# Altium project LcMcu.PrjPcb
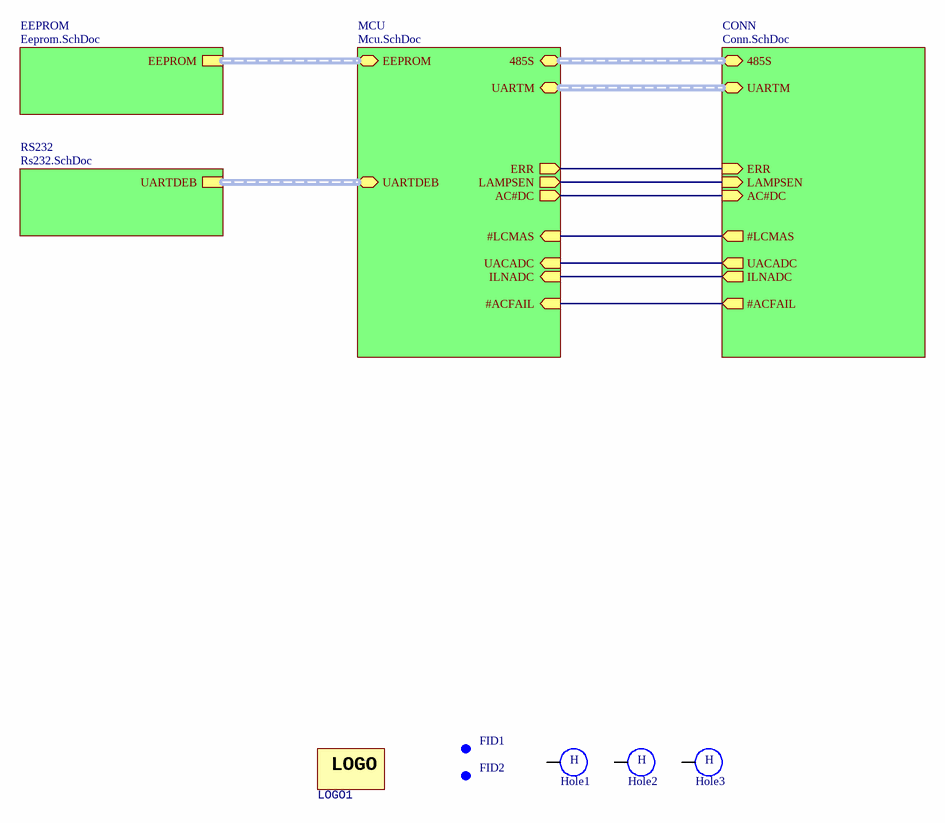
[diagram p0: Top.SchDoc]
ver: 1.0
5 sheets, 45 parts. Net scope: hierarchical (ports join the sheet entries above them; power ports are global).
Board file: LcMcu.PcbDoc
Sheets:
  Top.SchDoc
    MCU = Mcu.SchDoc
    CONN = Conn.SchDoc
    EEPROM = Eeprom.SchDoc
    RS232 = Rs232.SchDoc

## Sheet Top.SchDoc: Test
size A4; DrawnBy: Łukasz Przeniosło; Organization: Zachodniopomorski; Address1: Uniwersytet Technologiczny; Address2: w Szczecinie; Address3: Wydział Elektryczny; DocumentNumber: 1111; Revision: 1.0; SheetNumber: 0; SheetTotal: 0

### Parts
FID1  Fiducial  [Fid Round]  (value not drawn)  (no BOM)
FID2  Fiducial  [Fid Round]  (value not drawn)  (no BOM)
Hole1  Hole  [HOLE-6/3.2]  (value not drawn)
Hole2  Hole  [HOLE-6/3.2]  (value not drawn)
Hole3  Hole  [HOLE-6/3.2]  (value not drawn)
LOGO1  Logo  [LOGO_BEMKO]  (value not drawn)

### Sub-sheets
CONN = Conn.SchDoc: UACADC (out), ILNADC (out), #LCMAS (out), #ACFAIL (out), ERR (in), UARTM (harness UARTM), 485S (harness 485S), LAMPSEN (in), AC#DC (in)
EEPROM = Eeprom.SchDoc: EEPROM (harness EEPROM)
MCU = Mcu.SchDoc: UACADC (in), ILNADC (in), #ACFAIL (in), ERR (out), LAMPSEN (out), AC#DC (out), 485S (harness 485S), UARTM (harness UARTM), #LCMAS (in), EEPROM (harness EEPROM), UARTDEB
RS232 = Rs232.SchDoc: UARTDEB (harness UARTDEB)

### Nets
#ACFAIL: sheet MCU/#ACFAIL, sheet CONN/#ACFAIL
#LCMAS: sheet MCU/#LCMAS, sheet CONN/#LCMAS
AC#DC: sheet MCU/AC#DC, sheet CONN/AC#DC
ERR: sheet MCU/ERR, sheet CONN/ERR
ILNADC: sheet MCU/ILNADC, sheet CONN/ILNADC
LAMPSEN: sheet MCU/LAMPSEN, sheet CONN/LAMPSEN
UACADC: sheet MCU/UACADC, sheet CONN/UACADC

Not connected (* = marked no-connect by the designer): Hole1 1; Hole2 1; Hole3 1

### Buses and harness runs
harness sheet CONN/485S = sheet MCU/485S
harness sheet CONN/UARTM = sheet MCU/UARTM
harness sheet EEPROM/EEPROM = sheet MCU/EEPROM
harness sheet MCU/UARTDEB = sheet RS232/UARTDEB

### Notes on the sheet
- Title
- Size:
- Date:
- A4
- Author:
- Time:
- Sheet
- of
- File:
- (in symbol HOLE_) H
- (in symbol Logo) LOGO

### Library data of the parts
FID1 FID2 = FID ROUND: round fiducial
Hole1-Hole3 = HOLE_

## Sheet Mcu.SchDoc: Test
size A4; DrawnBy: Łukasz Przeniosło; Organization: Zachodniopomorski; Address1: Uniwersytet Technologiczny; Address2: w Szczecinie; Address3: Wydział Elektryczny; DocumentNumber: 1111; Revision: 1.0; SheetNumber: 0; SheetTotal: 0
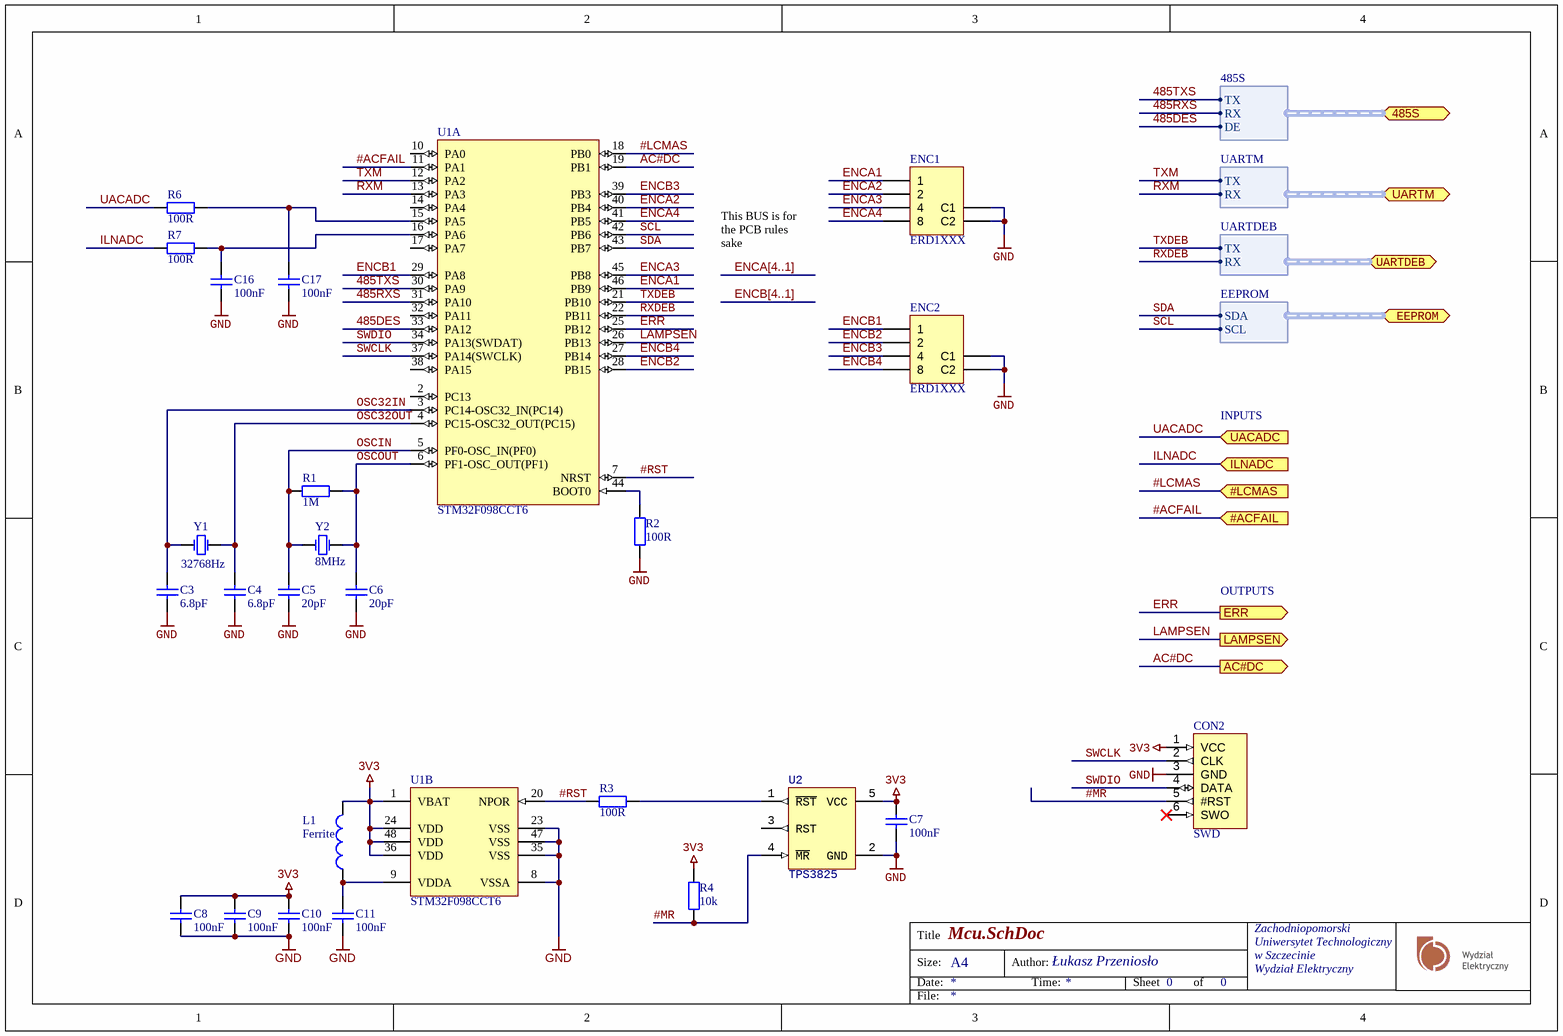
[diagram p1: Mcu.SchDoc]

### Parts
C3  6.8pF  [CAPC1608N]
C4  6.8pF  [CAPC1608N]
C5  20pF  [CAPC1608N]
C6  20pF  [CAPC1608N]
C7  100nF  [CAPC1608N]
C8  100nF  [CAPC1608N]
C9  100nF  [CAPC1608N]
C10  100nF  [CAPC1608N]
C11  100nF  [CAPC1608N]
C16  100nF  [CAPC1608N]
C17  100nF  [CAPC1608N]
CON2  SWD  [HEADER_6]
ENC1  ERD1XXX  [ERD]
ENC2  ERD1XXX  [ERD]
L1  Ferrite  [inductor_0603]
R1  1M  [RESC1608N]
R2  100R  [RESC1608N]
R3  100R  [RESC1608N]
R4  10k  [RESC1608N]
R6  100R  [RESC1608N]
R7  100R  [RESC1608N]
U1  STM32F098CCT6  [LQFP-48_L]  (parts A,B of 2)
U2  TPS3825  [SOT23-5-DBVR]
Y1  32768Hz  [ABS25-crystal]
Y2  8MHz  [HC49/4H_SMX]

### Ports
485S (harness 485S), #ACFAIL (in), #LCMAS (in), AC#DC (out), EEPROM (harness EEPROM), ERR (out), ILNADC (in), LAMPSEN (out), UACADC (in), UARTDEB (harness UARTDEB), UARTM (harness UARTM)

### Harnesses
485S: TX, RX, DE
UARTM: TX, RX
EEPROM: SDA, SCL
UARTDEB: TX, RX

### Nets
3V3: C7.2 C8.2 C9.2 C10.2 CON2.1(VCC) L1.2 R4.1 U1.1(VBAT) U1.24(VDD) U1.36(VDD) U1.48(VDD) U2.5(VCC)
GND: C3.1 C4.1 C5.2 C6.2 C7.1 C8.1 C9.1 C10.1 C11.1 C16.1 C17.2 CON2.3(GND) ENC1.C1 ENC1.C2 ENC2.C1 ENC2.C2 R2.2 U1.8(VSSA) U1.23(VSS) U1.35(VSS) U1.47(VSS) U2.2(GND)
485DES: U1.33(PA12) ; port 485S.DE
485RXS: U1.31(PA10) ; port 485S.RX
485TXS: U1.30(PA9) ; port 485S.TX
#ACFAIL: U1.11(PA1) ; port #ACFAIL
#LCMAS: U1.18(PB0) ; port #LCMAS
#MR: CON2.5(#RST) R4.2 U2.4(~{MR})
#RST: R3.1 U1.7(NRST) U1.20(NPOR)
AC#DC: U1.19(PB1) ; port AC#DC
ENCA1: ENC1.1 U1.46(PB9)
ENCA2: ENC1.2 U1.40(PB4)
ENCA3: ENC1.4 U1.45(PB8)
ENCA4: ENC1.8 U1.41(PB5)
ENCB1: ENC2.1 U1.29(PA8)
ENCB2: ENC2.2 U1.28(PB15)
ENCB3: ENC2.4 U1.39(PB3)
ENCB4: ENC2.8 U1.27(PB14)
ERR: U1.25(PB12) ; port ERR
ILNADC: R7.1 ; port ILNADC
LAMPSEN: U1.26(PB13) ; port LAMPSEN
OSC32IN: C3.2 U1.3(PC14-OSC32_IN(PC14)) Y1.1(OSC1)
OSC32OUT: C4.2 U1.4(PC15-OSC32_OUT(PC15)) Y1.2(OSC2)
OSCIN: C5.1 R1.1 U1.5(PF0-OSC_IN(PF0)) Y2.2(OSC2)
OSCOUT: C6.1 R1.2 U1.6(PF1-OSC_OUT(PF1)) Y2.1(OSC1)
RXDEB: U1.22(PB11) ; port UARTDEB.RX
RXM: U1.13(PA3) ; port UARTM.RX
SCL: U1.42(PB6) ; port EEPROM.SCL
SDA: U1.43(PB7) ; port EEPROM.SDA
SWCLK: CON2.2(CLK) U1.37(PA14(SWCLK))
SWDIO: CON2.4(DATA) U1.34(PA13(SWDAT))
TXDEB: U1.21(PB10) ; port UARTDEB.TX
TXM: U1.12(PA2) ; port UARTM.TX
UACADC: R6.1 ; port UACADC
NetC11_2: C11.2 L1.1 U1.9(VDDA)
NetC16_2: C16.2 R7.2 U1.16(PA6)
NetC17_1: C17.1 R6.2 U1.15(PA5)
NetR2_1: R2.1 U1.44(BOOT0)
NetR3_2: R3.2 U2.1(~{RST})

Not connected (* = marked no-connect by the designer): CON2 6(SWO)*; U1 2(PC13) 10(PA0) 14(PA4) 17(PA7) 32(PA11) 38(PA15); U2 3(RST)

### Buses and harness runs
bus ENCA[4..1]
bus ENCB[4..1]

### Notes on the sheet
- This BUS is for the PCB rules sake
- INPUTS
- OUTPUTS
- Title
- Size:
- Date:
- A4
- Author:
- Time:
- Sheet
- of
- File:

### Library data of the parts
C3-C11 C16 C17 = Capacitor
  C3 C4: Value: 6.8pF
  C5 C6: Value: 20pF
  C7-C11 C16 C17: Value: 100nF
CON2 = SWD-HEADER
L1 = Inductor: Code_IEC: 1005; Value: 10mH; Published: 8-Jun-2000; LatestRevisionDate: 29-May-2009; LatestRevisionNote: IPC-7351 Footprint Added.; PackageReference: 0402-A; Publisher: Altium Limited; PackageDescription: Chip Inductor; Code_JEITA: 0402
R1 = Resistor: Power: 0W; Tolerance: 5%; Value: 1M
R2-R4 R6 R7 = Resistor: Tolerance: 5%; Power: 0W
  R2 R3 R6 R7: Value: 100R
  R4: Value: 10k
U1 = STM32F098CCT6: PartNumber: STM32F051C6T6; Internal RAM Size (kB): 4; Operating Frequency(F) (Processor speed) (MHz): 48; Core: ARM Cortex-M0; FLASH Size (Prog) (kB): 32; Supply Voltage(Vcc) min (V): 2; Packing: Tray; I/Os (High Current): 39; ComponentLink3URL: http://www.st.com/st-web-ui/static/active/en/resource/technical/document/datasheet/DM00058181.pdf; Mounting Technology: Surface Mount; PackageDescription: 48-Pin Low Profile Quad Flat Package, 7 x 7 mm Body, 0.5 mm Pitch; PackageReference: LQFP48; ComponentLink1Description: Manufacturer URL; ComponentLink1URL: http://www.st.com/web/en/home.html; ComponentLink2URL: http://www.st.com/st-web-ui/static/active/en/resource/technical/document/datasheet/DM00039193.pdf; PackageVersion: Rev. 6, 06/2013; ComponentLink2Description: Datasheet; ComponentLink3Description: Package Specification; DatasheetVersion: Rev. 3; PartId: 1
U2 = TPS3825: Układ nadzorujący; procesor, układ nadzorujący; push-pull
Y1 = HC49: ABS25-32.768KHZ; Value: 32768Hz
Y2 = HC49: Value: 8MHz

## Sheet Conn.SchDoc: Test
size A4; DrawnBy: Łukasz Przeniosło; Organization: Zachodniopomorski; Address1: Uniwersytet Technologiczny; Address2: w Szczecinie; Address3: Wydział Elektryczny; DocumentNumber: 1111; Revision: 1.0; SheetNumber: 0; SheetTotal: 0
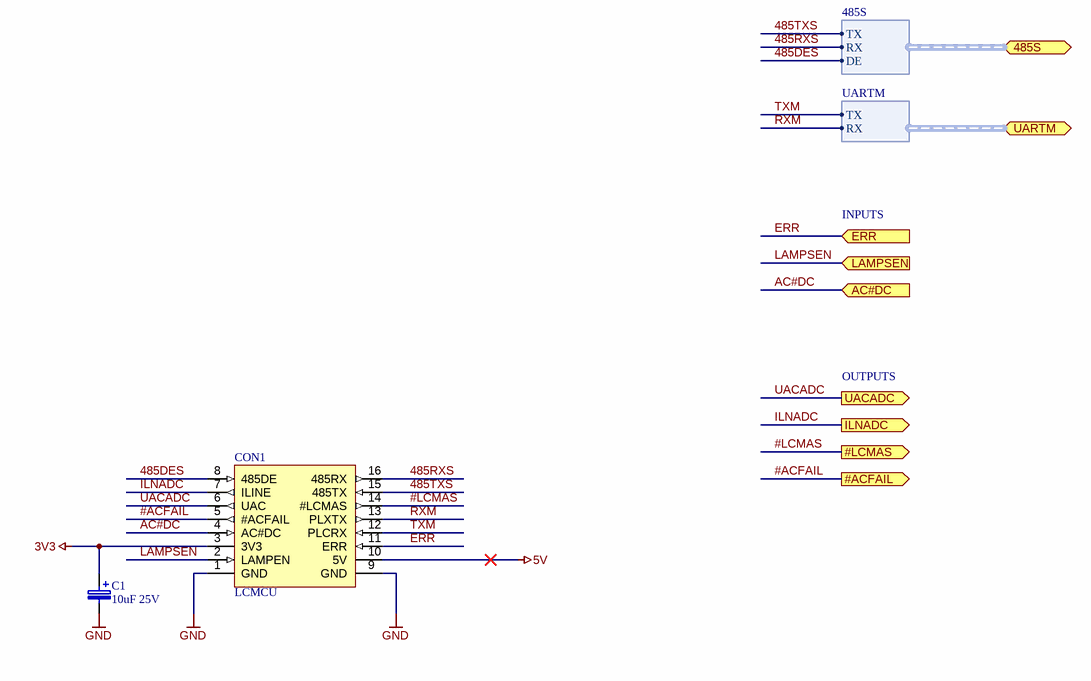
[diagram p2: Conn.SchDoc]

### Parts
C1  10uF 25V  [SMDB]
CON1  LCMCU  [IDC_FEM_BOT_16]

### Ports
485S (harness 485S), #ACFAIL (out), #LCMAS (out), AC#DC (in), ERR (in), ILNADC (out), LAMPSEN (in), UACADC (out), UARTM (harness UARTM)

### Harnesses
485S: TX, RX, DE
UARTM: TX, RX

### Nets
3V3: C1.1 CON1.3(3V3)
5V: CON1.10(5V)
GND: C1.2 CON1.1(GND) CON1.9(GND)
485DES: CON1.8(485DE) ; port 485S.DE
485RXS: CON1.16(485RX) ; port 485S.RX
485TXS: CON1.15(485TX) ; port 485S.TX
#ACFAIL: CON1.5(#ACFAIL) ; port #ACFAIL
#LCMAS: CON1.14(#LCMAS) ; port #LCMAS
AC#DC: CON1.4(AC#DC) ; port AC#DC
ERR: CON1.11(ERR) ; port ERR
ILNADC: CON1.7(ILINE) ; port ILNADC
LAMPSEN: CON1.2(LAMPEN) ; port LAMPSEN
RXM: CON1.13(PLXTX) ; port UARTM.RX
TXM: CON1.12(PLCRX) ; port UARTM.TX
UACADC: CON1.6(UAC) ; port UACADC

### Notes on the sheet
- INPUTS
- OUTPUTS
- Title
- Size:
- Date:
- A4
- Author:
- Time:
- Sheet
- of
- File:

### Library data of the parts
C1 = Capacitor Tantalum: Value: 10uF 25V

## Sheet Eeprom.SchDoc: Oven Driver
size A4; DrawnBy: Łukasz Przeniosło; Organization: Altium Limited; Address1: L3, 12a Rodborough Rd; Address2: Frenchs Forest; Address3: NSW; Address4: Australia 2086; DocumentNumber: 12; SheetNumber: 12; SheetTotal: 13; Number: MS02-50-42-00; Time: Oven Driver
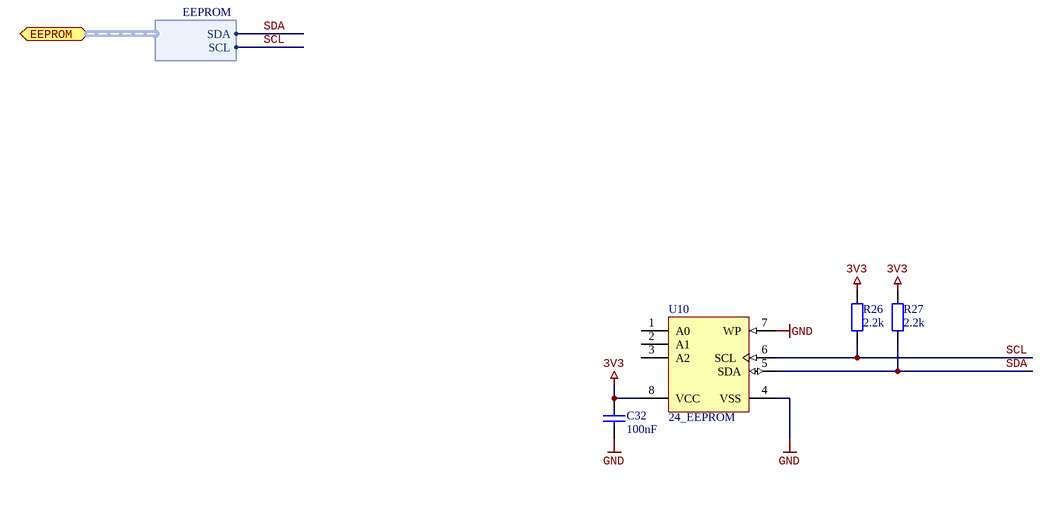
[diagram p3: Eeprom.SchDoc]

### Parts
C32  100nF  [CAPC1608N]
R26  2.2k  [RESC1608N]
R27  2.2k  [RESC1608N]
U10  24_EEPROM  [SO-8_L]

### Ports
EEPROM (harness EEPROM)

### Harnesses
EEPROM: SDA, SCL

### Nets
3V3: C32.1 R26.1 R27.1 U10.8(VCC)
GND: C32.2 U10.4(VSS) U10.7(WP)
SCL: R26.2 U10.6(SCL) ; port EEPROM.SCL
SDA: R27.2 U10.5(SDA) ; port EEPROM.SDA

Not connected (* = marked no-connect by the designer): U10 1(A0) 2(A1) 3(A2)

### Notes on the sheet
- Title:
- Date:
- Drawn by:
- Project:
- Time:
- Number:
- Sheet
- of
- File:

### Library data of the parts
C32 = Capacitor: Value: 100nF
R26 R27 = Resistor: Power: 0W; Tolerance: 5%; Value: 2.2k
U10 = 24_EEPROM: 16Kbit, 400kHz, 2.5V, I2C Serial EEPROM, 8-Pin SOIC 150mil, Extended Temperature; DatasheetVersion: revA, Nov-2008; Code_JEDEC: MS-012; PackageDescription: 8-Lead Plastic Small Outline (SN) - Narrow, 3.90mm Body [SOIC]; Code_IPC: SOIC127P600-8; PackageReference: SOIC-SN8; PackageVersion: revBB, Aug-2009

## Sheet Rs232.SchDoc: Oven Driver
size A4; DrawnBy: Łukasz Przeniosło; Organization: Altium Limited; Address1: L3, 12a Rodborough Rd; Address2: Frenchs Forest; Address3: NSW; Address4: Australia 2086; DocumentNumber: 10; SheetNumber: 10; SheetTotal: 13; Number: MS02-50-42-00; Time: Oven Driver
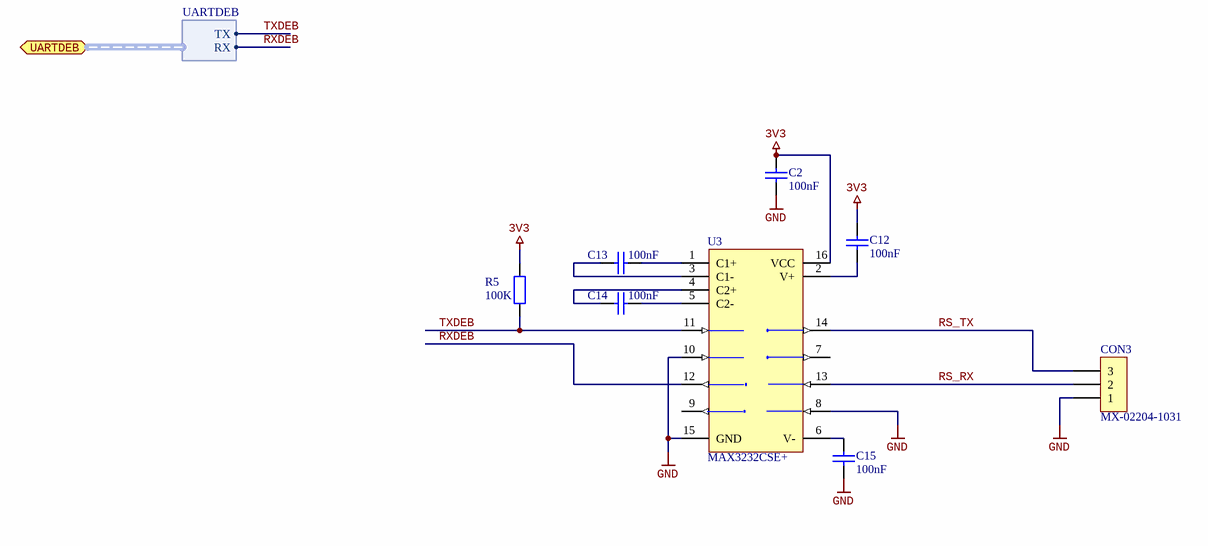
[diagram p4: Rs232.SchDoc]

### Parts
C2  100nF  [CAPC1608N]
C12  100nF  [CAPC1608N]
C13  100nF  [CAPC1608N]
C14  100nF  [CAPC1608N]
C15  100nF  [CAPC1608N]
CON3  MX-02204-1031  [MX-02204-1031]
R5  100K  [RESC1608N]
U3  MAX3232CSE+  [SO16_N]

### Ports
UARTDEB (harness UARTDEB)

### Harnesses
UARTDEB: TX, RX

### Nets
3V3: C2.2 C12.2 R5.2 U3.16(VCC)
GND: C2.1 C15.1 CON3.1 U3.8(R2IN) U3.10(T2IN) U3.15(GND)
RS_RX: CON3.2 U3.13(R1IN)
RS_TX: CON3.3 U3.14(T1OUT)
RXDEB: U3.12(R1OUT) ; port UARTDEB.RX
TXDEB: R5.1 U3.11(T1IN) ; port UARTDEB.TX
NetC12_1: C12.1 U3.2(V+)
NetC13_1: C13.1 U3.3(C1-)
NetC13_2: C13.2 U3.1(C1+)
NetC14_1: C14.1 U3.4(C2+)
NetC14_2: C14.2 U3.5(C2-)
NetC15_2: C15.2 U3.6(V-)

Not connected (* = marked no-connect by the designer): U3 7(T2OUT) 9(R2OUT)

### Notes on the sheet
- Title:
- Date:
- Drawn by:
- Project:
- Time:
- Number:
- Sheet
- of
- File:

### Library data of the parts
C2 C12-C15 = Capacitor: Value: 100nF
CON3 = MX-02204-1031: Pith 2.54mm, 3-pin; ComponentLink1Description: Manufacturer Link; ComponentLink2Description: Datasheet; Distributor: tme.pl; tme.pl: MX-6410-03A
R5 = Resistor: Power: 0W; Tolerance: 5%; Value: 100K
U3 = MAX3232CUE: 3.0V TO 5.5V, Low-Power, up to 1Mbps, True RS-232 Transceiver Using Four 0.1µF External Capacitor; Published: 16-Jan-2001; LatestRevisionDate: 29-May-2009; LatestRevisionNote: IPC-7351 Footprint Added.; DatasheetVersion: Mar-1999; PackageVersion: 21-0066 C; PackageReference: TSSOP16; Publisher: Altium Limited; PackageDescription: 16-Pin Thin Small Outline Package 0.65 mm Pitch; ComponentLink1Description: Manufacturer Link; ComponentLink1URL: http://www.maxim-ic.com/; ComponentLink2Description: Datasheet; ComponentLink2URL: http://pdfserv.maxim-ic.com/en/ds/MAX3222-MAX3241.pdf

## Nets that join several sheets
3V3: Mcu (12 pins), Conn (C1.1 CON1.3), Eeprom (C32.1 R26.1 R27.1 U10.8), Rs232 (C2.2 C12.2 R5.2 U3.16)
GND: Mcu (22 pins), Conn (C1.2 CON1.1 CON1.9), Eeprom (C32.2 U10.4 U10.7), Rs232 (6 pins)
485DES: Mcu (U1.33), Conn (CON1.8)
485RXS: Mcu (U1.31), Conn (CON1.16)
485TXS: Mcu (U1.30), Conn (CON1.15)
#ACFAIL: Mcu (U1.11), Conn (CON1.5)
#LCMAS: Mcu (U1.18), Conn (CON1.14)
AC#DC: Mcu (U1.19), Conn (CON1.4)
ERR: Mcu (U1.25), Conn (CON1.11)
ILNADC: Mcu (R7.1), Conn (CON1.7)
LAMPSEN: Mcu (U1.26), Conn (CON1.2)
RXDEB: Mcu (U1.22), Rs232 (U3.12)
RXM: Mcu (U1.13), Conn (CON1.13)
SCL: Mcu (U1.42), Eeprom (R26.2 U10.6)
SDA: Mcu (U1.43), Eeprom (R27.2 U10.5)
TXDEB: Mcu (U1.21), Rs232 (R5.1 U3.11)
TXM: Mcu (U1.12), Conn (CON1.12)
UACADC: Mcu (R6.1), Conn (CON1.6)